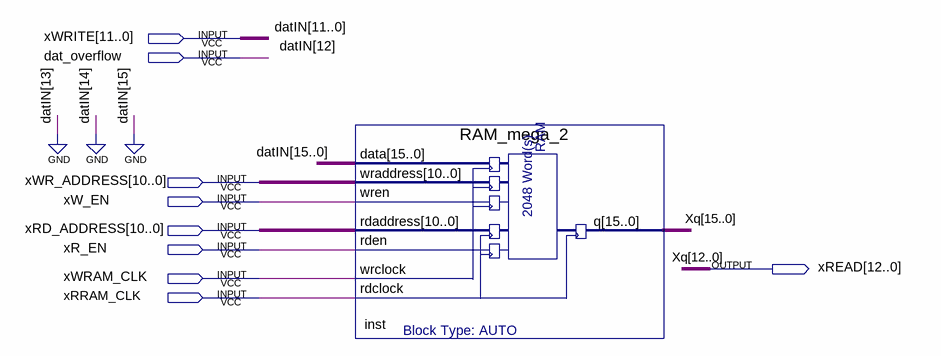
[diagram p0: schematic sheet]
// Quartus schematic RAM_12bit.bdf as structural Verilog: 1 symbols, 9 pins
module RAM_12bit (
  input  [11:0] xWRITE,
  input  dat_overflow,
  input  [10:0] xWR_ADDRESS,
  input  xW_EN,
  input  [10:0] xRD_ADDRESS,
  input  xR_EN,
  input  xWRAM_CLK,
  input  xRRAM_CLK,
  output [12:0] xREAD
);

  wire [15:13] Xq;

  RAM_mega_2 inst (
    .data({3'b000, dat_overflow, xWRITE}), .wraddress(xWR_ADDRESS), .wren(xW_EN), .rdaddress(xRD_ADDRESS),
    .rden(xR_EN), .wrclock(xWRAM_CLK), .rdclock(xRRAM_CLK), .q({Xq, xREAD}));

  // Other names for the same wires on the sheet: datIN[12:0] = {dat_overflow, xWRITE}; Xq[12:0] = xREAD
endmodule
